# EAGLE schematic mainboard (EAGLE 9.4.2)

## Sheet 1 of 2
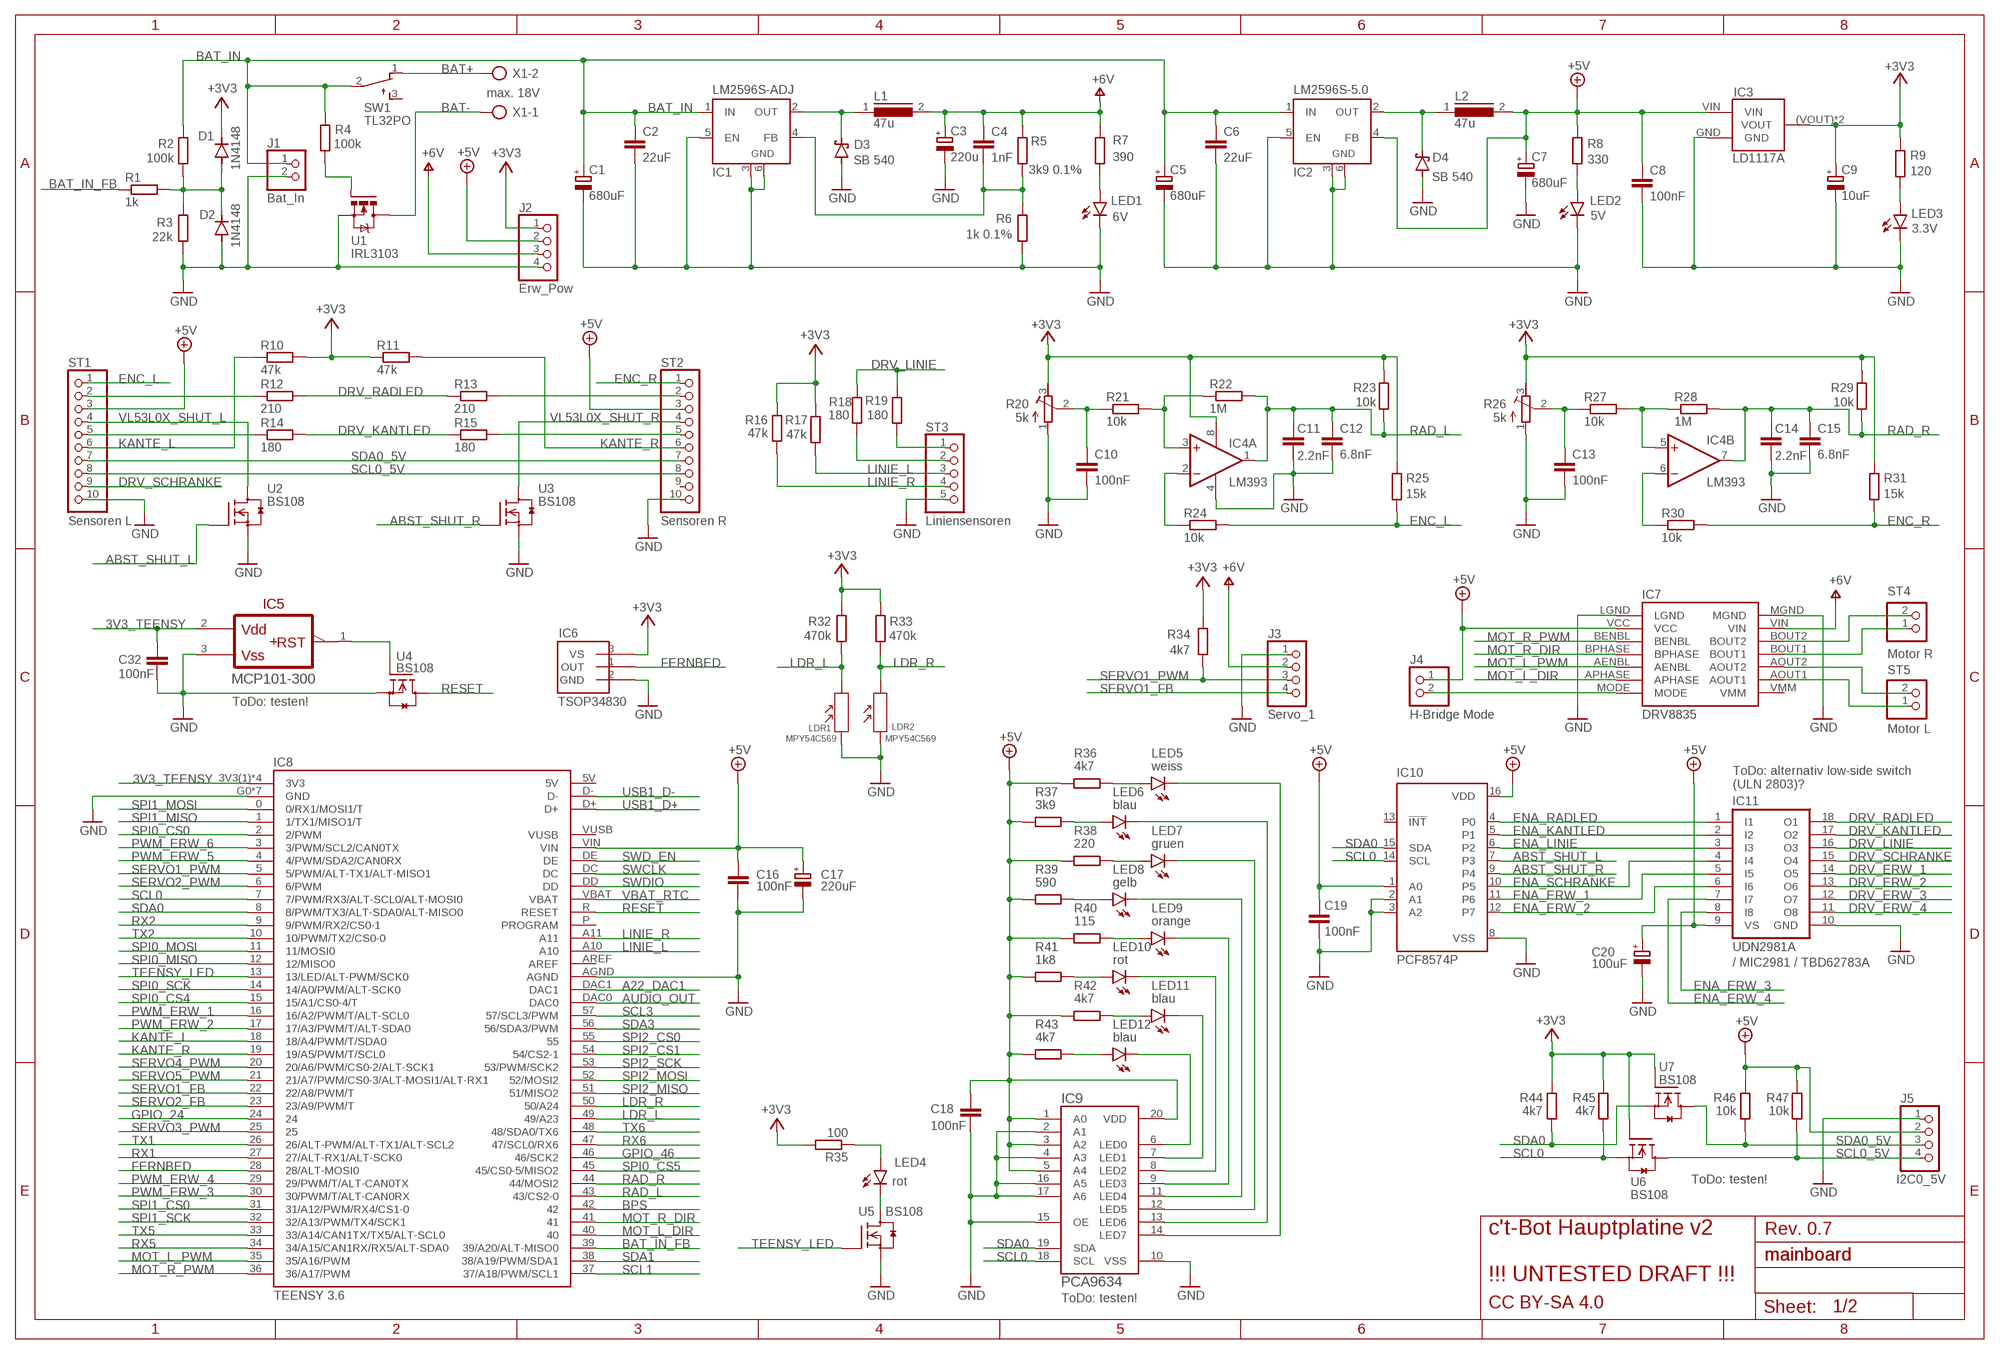
[diagram p0: schematic, sheet 1]

### Parts
C1  680uF  CPOL-EUE5-10.5  [E5-10,5]
C2  22uF  C-EU025-025X050  [C025-025X050]
C3  220u  CPOL-EUE5-10.5  [E5-10,5]
C4  1nF  C-EU025-025X050  [C025-025X050]
C5  680uF  CPOL-EUE5-10.5  [E5-10,5]
C6  22uF  C-EU025-025X050  [C025-025X050]
C7  680uF  CPOL-EUE5-10.5  [E5-10,5]
C8  100nF  C-EU025-025X050  [C025-025X050]
C9  10uF  CPOL-EUE2-5  [E2-5]
C10  100nF  C-EU025-025X050  [C025-025X050]
C11  2.2nF  C-EU025-025X050  [C025-025X050]
C12  6.8nF  C-EU025-025X050  [C025-025X050]
C13  100nF  C-EU025-025X050  [C025-025X050]
C14  2.2nF  C-EU025-025X050  [C025-025X050]
C15  6.8nF  C-EU025-025X050  [C025-025X050]
C16  100nF  C-EU025-025X050  [C025-025X050]
C17  220uF  CPOL-EUE2-5  [E2-5]
C18  100nF  C-EU025-025X050  [C025-025X050]
C19  100nF  C-EU025-025X050  [C025-025X050]
C20  100uF  CPOL-EUE2-5  [E2-5]
C32  100nF  C-EU025-025X050  [C025-025X050]
D1  1N4148  1N41480207/2V  [0207/2V]
D2  1N4148  1N41480207/2V  [0207/2V]
D3  SB 540  SCHOTTKY-DIODEDO201T15  [DO201T15]
D4  SB 540  SCHOTTKY-DIODEDO201T15  [DO201T15]
IC1  LM2596S-ADJ  LM2596S  [TO263-5]
IC2  LM2596S-5.0  LM2596S  [TO263-5]
IC3  LD1117A  LD1117  [LD1117SOT-223]
IC4  LM393  LM393N  [DIL08]
IC5  MCP101-300  MCP101  [TO-92]
IC6  TSOP34830  [TSOP348]
IC7  DRV8835  DRV8835THROUGHHOLE  [DRV8835]
IC8  TEENSY 3.6  TEENSY3_6  [T36]
IC9  PCA9634  PCA9634-SO20  [SO20W]
IC10  PCF8574P  [DIL16]
IC11  UDN2981A  [DIL18]
J1  Bat_In  PINHD-1X2  [1X02]
J2  Erw_Pow  PINHD-1X4  [1X04]
J3  Servo_1  PINHD-1X4  [1X04]
J4  H-Bridge Mode  PINHD-1X2  [1X02]
J5  I2C0_5V  PINHD-1X4  [1X04]
L1  47u  INDUCTOR_09HCP  [09HCP]
L2  47u  INDUCTOR_09HCP  [09HCP]
LDR1  MPY54C569  [SNR2-3.0]
LDR2  MPY54C569  [SNR2-3.0]
LED1  6V  LED3MM  [LED3MM]
LED2  5V  LED3MM  [LED3MM]
LED3  3.3V  LED3MM  [LED3MM]
LED4  rot  LED3MM  [LED3MM]
LED5  weiss  LED3MM  [LED3MM]
LED6  blau  LED3MM  [LED3MM]
LED7  gruen  LED3MM  [LED3MM]
LED8  gelb  LED3MM  [LED3MM]
LED9  orange  LED3MM  [LED3MM]
LED10  rot  LED3MM  [LED3MM]
LED11  blau  LED3MM  [LED3MM]
LED12  blau  LED3MM  [LED3MM]
R1  1k  R-EU_0204/2V  [0204V]
R2  100k  R-EU_0204/2V  [0204V]
R3  22k  R-EU_0204/2V  [0204V]
R4  100k  R-EU_0204/2V  [0204V]
R5  3k9 0.1%  R-EU_0204/2V  [0204V]
R6  1k 0.1%  R-EU_0204/2V  [0204V]
R7  390  R-EU_0204/2V  [0204V]
R8  330  R-EU_0204/2V  [0204V]
R9  120  R-EU_0204/2V  [0204V]
R10  47k  R-EU_0204/2V  [0204V]
R11  47k  R-EU_0204/2V  [0204V]
R12  210  R-EU_0204/2V  [0204V]
R13  210  R-EU_0204/2V  [0204V]
R14  180  R-EU_0204/2V  [0204V]
R15  180  R-EU_0204/2V  [0204V]
R16  47k  R-EU_0204/2V  [0204V]
R17  47k  R-EU_0204/2V  [0204V]
R18  180  R-EU_0204/2V  [0204V]
R19  180  R-EU_0204/2V  [0204V]
R20  5k  R-TRIMM64W  [RTRIM64W]
R21  10k  R-EU_0204/2V  [0204V]
R22  1M  R-EU_0204/2V  [0204V]
R23  10k  R-EU_0204/2V  [0204V]
R24  10k  R-EU_0204/2V  [0204V]
R25  15k  R-EU_0204/2V  [0204V]
R26  5k  R-TRIMM64W  [RTRIM64W]
R27  10k  R-EU_0204/2V  [0204V]
R28  1M  R-EU_0204/2V  [0204V]
R29  10k  R-EU_0204/2V  [0204V]
R30  10k  R-EU_0204/2V  [0204V]
R31  15k  R-EU_0204/2V  [0204V]
R32  470k  R-EU_0204/2V  [0204V]
R33  470k  R-EU_0204/2V  [0204V]
R34  4k7  R-EU_0204/2V  [0204V]
R35  100  R-EU_0204/2V  [0204V]
R36  4k7  R-EU_0204/2V  [0204V]
R37  3k9  R-EU_0204/2V  [0204V]
R38  220  R-EU_0204/2V  [0204V]
R39  590  R-EU_0204/2V  [0204V]
R40  115  R-EU_0204/2V  [0204V]
R41  1k8  R-EU_0204/2V  [0204V]
R42  4k7  R-EU_0204/2V  [0204V]
R43  4k7  R-EU_0204/2V  [0204V]
R44  4k7  R-EU_0204/2V  [0204V]
R45  4k7  R-EU_0204/2V  [0204V]
R46  10k  R-EU_0204/2V  [0204V]
R47  10k  R-EU_0204/2V  [0204V]
ST1  Sensoren L  PS25-10PS25-10  [TS_PS25_10]
ST2  Sensoren R  PS25-10PS25-10  [TS_PS25_10]
ST3  Liniensensoren  PS25-5PS25-5  [TS_PS25_5]
ST4  Motor R  PINHD90-1X2/90  [1X02/90]
ST5  Motor L  PINHD90-1X2/90  [1X02/90]
SW1  TL32PO  [TL3XPO]
U1  IRL3103  IRF740  [TO220BV]
U2  BS108  [SOT54E]
U3  BS108  [SOT54E]
U4  BS108  [SOT54E]
U5  BS108  [SOT54E]
U6  BS108  [SOT54E]
U7  BS108  [SOT54E]
X1  max. 18V  SCHRAUBKLEMME/2  [AK500/2-H]

### Nets
3V3_TEENSY: C32.1 IC5.2(VDD) IC8.3V3(1)(3V3) IC8.3V3(2)(3V3) IC8.3V3(3)(3V3) IC8.3V3(4)(3V3) ; also sheet 2
+3V3 [power]: C9.+ D1.2(C) IC3.(VOUT)(VOUT) IC3.VOUT IC4.8(P:V+) IC6.3(VS) J2.1 R9.2 R10.2 R11.1 R16.2 R17.2 R20.3(E) R23.2 R25.2 R26.3(E) R29.2 R31.2 R32.2 R33.2 R34.2 R35.2 R44.2 R45.2 U6.G U7.G ; also sheet 2
+5V [power]: C7.+ C8.1 C16.1 C17.+ C18.1 C19.1 C20.+ IC2.4(FB) IC3.VIN IC7.VCC IC8.VIN IC9.1(A0) IC9.3(A2) IC9.5(A4) IC9.20(VDD) IC10.1(A0) IC10.16(VDD) IC11.9(VS) J2.2 J4.1 J5.2 L2.2 R8.2 R36.1 R37.1 R38.1 R39.1 R40.1 R41.1 R42.1 R43.1 R46.2 R47.2 ST1.3 ST2.3 ; also sheet 2
+6V [high_current]: C3.+ C4.1 IC7.VIN J2.3 J3.2 L1.2 R5.2 R7.1 ; also sheet 2
A22_DAC1: IC8.DAC1 ; also sheet 2
ABST_SHUT_L: IC10.7(P3) U2.G
ABST_SHUT_R: IC10.9(P4) U3.G
AUDIO_OUT: IC8.DAC0 ; also sheet 2
BAT+ [high_current]: SW1.1(O) X1.2
BAT- [high_current]: U1.D X1.1
BAT_IN [high_current]: C1.+ C2.1 C5.+ C6.1 IC1.1(IN) IC2.1(IN) J1.1 R2.2 R4.2 SW1.2(P)
BAT_IN_FB: IC8.39(39/A20/ALT-MISO0) R1.1
BPS: IC8.42 ; also sheet 2
DRV_ERW_1 [power]: IC11.14(O5) ; also sheet 2
DRV_ERW_2 [power]: IC11.13(O6) ; also sheet 2
DRV_ERW_3 [power]: IC11.12(O7) ; also sheet 2
DRV_ERW_4 [power]: IC11.11(O8) ; also sheet 2
DRV_KANTLED [power]: IC11.17(O2) R14.2 R15.1
DRV_LINIE [power]: IC11.16(O3) R18.2 R19.2
DRV_RADLED [power]: IC11.18(O1) R12.2 R13.1
DRV_SCHRANKE [power]: IC11.15(O4) ST1.9
ENA_ERW_1: IC10.11(P6) IC11.5(I5) ; also sheet 2
ENA_ERW_2: IC10.12(P7) IC11.6(I6) ; also sheet 2
ENA_ERW_3: IC11.8(I8) ; also sheet 2
ENA_ERW_4: IC11.7(I7) ; also sheet 2
ENA_KANTLED: IC10.5(P1) IC11.2(I2)
ENA_LINIE: IC10.6(P2) IC11.3(I3)
ENA_RADLED: IC10.4(P0) IC11.1(I1)
ENA_SCHRANKE: IC10.10(P5) IC11.4(I4)
ENC_L: R24.2 R25.1 ST1.1
ENC_R: R30.2 R31.1 ST2.1
FERNBED: IC6.1(OUT) IC8.28(28/ALT-MOSI0)
GND [power]: C1.- C2.2 C3.- C5.- C6.2 C7.- C8.2 C9.- C10.2 C11.2 C12.2 C13.2 C14.2 C15.2 C16.2 C17.- C18.2 C19.2 C20.- C32.2 D2.1(A) D3.A D4.A IC1.3(GND) IC1.5(EN) IC1.6(GND) IC2.3(GND) IC2.5(EN) IC2.6(GND) IC3.GND IC4.4(P:V-) IC5.3(VSS) IC6.2(GND) IC7.LGND IC7.MGND IC8.AGND IC8.G0(GND) IC8.G1(GND) IC8.G2(GND) IC8.G3(GND) IC8.G4(GND) IC8.G5(GND) IC8.G6(GND) IC9.2(A1) IC9.4(A3) IC9.10(VSS) IC9.15(OE) IC9.16(A5) IC9.17(A6) IC10.2(A1) IC10.3(A2) IC10.8(VSS) IC11.10(GND) J1.2 J2.4 J3.1 J5.1 LDR1.1 LDR2.1 LED1.K(C) LED2.K(C) LED3.K(C) R3.1 R6.1 R20.1(A) R26.1(A) ST1.10 ST2.10 ST3.5 U1.S U2.S U3.S U4.S U5.S ; also sheet 2
GPIO_24: IC8.24 ; also sheet 2
GPIO_46: IC8.46(46/SCK2) ; also sheet 2
KANTE_L: IC8.18(18/A4/PWM/T/SDA0) R10.1 ST1.6
KANTE_R: IC8.19(19/A5/PWM/T/SCL0) R11.2 ST2.6
LDR_L: IC8.49(49/A23) LDR1.2 R32.1
LDR_R: IC8.50(50/A24) LDR2.2 R33.1
LINIE_L: IC8.A10 R17.1 ST3.3
LINIE_R: IC8.A11 R16.1 ST3.4
MOT_L_1 [high_current]: IC7.AOUT1 ST5.1
MOT_L_2 [high_current]: IC7.AOUT2 ST5.2
MOT_L_DIR: IC7.APHASE IC8.40
MOT_L_PWM: IC7.AENBL IC8.35(35/A16/PWM)
MOT_R_1 [high_current]: IC7.BOUT1 ST4.1
MOT_R_2 [high_current]: IC7.BOUT2 ST4.2
MOT_R_DIR: IC7.BPHASE IC8.41
MOT_R_PWM: IC7.BENBL IC8.36(36/A17/PWM)
N$1: R18.1 ST3.2
N$2: LED3.A R9.1
N$3: IC7.MODE J4.2
N$4: D1.1(A) D2.2(C) R1.2 R2.1 R3.2
N$5: IC4.2(A:-IN) R24.1
N$6: IC9.6(LED0) LED12.K(C)
N$7: IC9.7(LED1) LED11.K(C)
N$8 [power]: LED1.A R7.2
N$9: C4.2 IC1.4(FB) R5.1 R6.2
N$10: IC4.6(B:-IN) R30.1
N$11: LED2.A R8.1
N$13: IC9.8(LED2) LED10.K(C)
N$15: IC9.9(LED3) LED9.K(C)
N$16: IC9.11(LED4) LED8.K(C)
N$17: IC9.12(LED5) LED7.K(C)
N$18: IC9.13(LED6) LED6.K(C)
N$19: IC9.14(LED7) LED5.K(C)
N$20: LED5.A R36.2
N$21: LED6.A R37.2
N$22: LED7.A R38.2
N$23: LED8.A R39.2
N$24: LED9.A R40.2
N$25: LED10.A R41.2
N$26: LED11.A R42.2
N$27: LED12.A R43.2
N$28: LED4.A R35.1
N$29: LED4.K(C) U5.D
N$30: R19.1 ST3.1
N$34: C10.1 R20.2(S) R21.1
N$35: IC4.3(A:+IN) R21.2 R22.1
N$36: C13.1 R26.2(S) R27.1
N$37: IC4.5(B:+IN) R27.2 R28.1
N$38: R4.1 U1.G
N$39: IC5.1(!RST) U4.G
N$45: R13.2 ST2.2
N$47: R12.1 ST1.2
N$51: R14.1 ST1.5
N$53: R15.2 ST2.5
PWM_ERW_1: IC8.16(16/A2/PWM/T/ALT-SCL0) ; also sheet 2
PWM_ERW_2: IC8.17(17/A3/PWM/T/ALT-SDA0) ; also sheet 2
PWM_ERW_3: IC8.30(30/PWM/T/ALT-CAN0RX) ; also sheet 2
PWM_ERW_4: IC8.29(29/PWM/T/ALT-CAN0TX) ; also sheet 2
PWM_ERW_5: IC8.4(4/PWM/SDA2/CAN0RX) ; also sheet 2
PWM_ERW_6: IC8.3(3/PWM/SCL2/CAN0TX) ; also sheet 2
RAD_L: C11.1 C12.1 IC4.1(A:OUT) IC8.43(43/CS2-0) R22.2 R23.1
RAD_R: C14.1 C15.1 IC4.7(B:OUT) IC8.44(44/MOSI2) R28.2 R29.1
RESET: IC8.R(RESET) U4.D ; also sheet 2
RX1: IC8.27(27/ALT-RX1/ALT-SCK0) ; also sheet 2
RX2: IC8.9(9/PWM/RX2/CS0-1) ; also sheet 2
RX5: IC8.34(34/A15/CAN1RX/RX5/ALT-SDA0) ; also sheet 2
RX6: IC8.47(47/SCL0/RX6) ; also sheet 2
SCL0: IC8.7(7/PWM/RX3/ALT-SCL0/ALT-MOSI0) IC9.18(SCL) IC10.14(SCL) R45.1 U6.S ; also sheet 2
SCL0_5V: J5.4 R47.1 ST1.8 ST2.8 U6.D ; also sheet 2
SCL1: IC8.37(37/A18/PWM/SCL1) ; also sheet 2
SCL3: IC8.57(57/SCL3/PWM) ; also sheet 2
SDA0: IC8.8(8/PWM/TX3/ALT-SDA0/ALT-MISO0) IC9.19(SDA) IC10.15(SDA) R44.1 U7.S ; also sheet 2
SDA0_5V: J5.3 R46.1 ST1.7 ST2.7 U7.D ; also sheet 2
SDA1: IC8.38(38/A19/PWM/SDA1) ; also sheet 2
SDA3: IC8.56(56/SDA3/PWM) ; also sheet 2
SERVO1_FB: IC8.22(22/A8/PWM/T) J3.4
SERVO1_PWM: IC8.5(5/PWM/ALT-TX1/ALT-MISO1) J3.3 R34.1
SERVO2_FB: IC8.23(23/A9/PWM/T) ; also sheet 2
SERVO2_PWM: IC8.6(6/PWM) ; also sheet 2
SERVO3_PWM: IC8.25 ; also sheet 2
SERVO4_PWM: IC8.20(20/A6/PWM/CS0-2/ALT-SCK1) ; also sheet 2
SERVO5_PWM: IC8.21(21/A7/PWM/CS0-3/ALT-MOSI1/ALT-RX1) ; also sheet 2
SPI0_CS0: IC8.2(2/PWM) ; also sheet 2
SPI0_CS4: IC8.15(15/A1/CS0-4/T) ; also sheet 2
SPI0_CS5: IC8.45(45/CS0-5/MISO2) ; also sheet 2
SPI0_MISO: IC8.12(12/MISO0) ; also sheet 2
SPI0_MOSI: IC8.11(11/MOSI0) ; also sheet 2
SPI0_SCK: IC8.14(14/A0/PWM/ALT-SCK0) ; also sheet 2
SPI1_CS0: IC8.31(31/A12/PWM/RX4/CS1-0) ; also sheet 2
SPI1_MISO: IC8.1(1/TX1/MISO1/T) ; also sheet 2
SPI1_MOSI: IC8.0(0/RX1/MOSI1/T) ; also sheet 2
SPI1_SCK: IC8.32(32/A13/PWM/TX4/SCK1) ; also sheet 2
SPI2_CS0: IC8.55 ; also sheet 2
SPI2_CS1: IC8.54(54/CS2-1) ; also sheet 2
SPI2_MISO: IC8.51(51/MISO2) ; also sheet 2
SPI2_MOSI: IC8.52(52/MOSI2) ; also sheet 2
SPI2_SCK: IC8.53(53/PWM/SCK2) ; also sheet 2
SWCLK: IC8.DC ; also sheet 2
SWD_EN: IC8.DE ; also sheet 2
SWDIO: IC8.DD ; also sheet 2
TEENSY_LED: IC8.13(13/LED/ALT-PWM/SCK0) U5.G
TX1: IC8.26(26/ALT-PWM/ALT-TX1/ALT-SCL2) ; also sheet 2
TX2: IC8.10(10/PWM/TX2/CS0-0) ; also sheet 2
TX5: IC8.33(33/A14/CAN1TX/TX5/ALT-SCL0) ; also sheet 2
TX6: IC8.48(48/SDA0/TX6) ; also sheet 2
USB1_D+: IC8.D+ ; also sheet 2
USB1_D-: IC8.D- ; also sheet 2
V5_L1 [high_current]: D4.C IC2.2(OUT) L2.1
V6_L1 [high_current]: D3.C IC1.2(OUT) L1.1
VBAT_RTC: IC8.VBAT ; also sheet 2
VL53L0X_SHUT_L: ST1.4 U2.D
VL53L0X_SHUT_R: ST2.4 U3.D
Unconnected: IC7.VMM IC8.5V IC8.AREF IC8.P(PROGRAM) IC8.VUSB IC10.13(!INT) ST2.9 SW1.3(S)

### Notes on the sheet
- ToDo: testen!
- ToDo: alternativ low-side switch
  (ULN 2803)?
- / MIC2981 / TBD62783A
- ToDo: testen!
- Rev. 0.7
- mainboard
- c't-Bot Hauptplatine v2
  
  !!! UNTESTED DRAFT !!!
- ToDo: testen!
- CC BY-SA 4.0

## Sheet 2 of 2
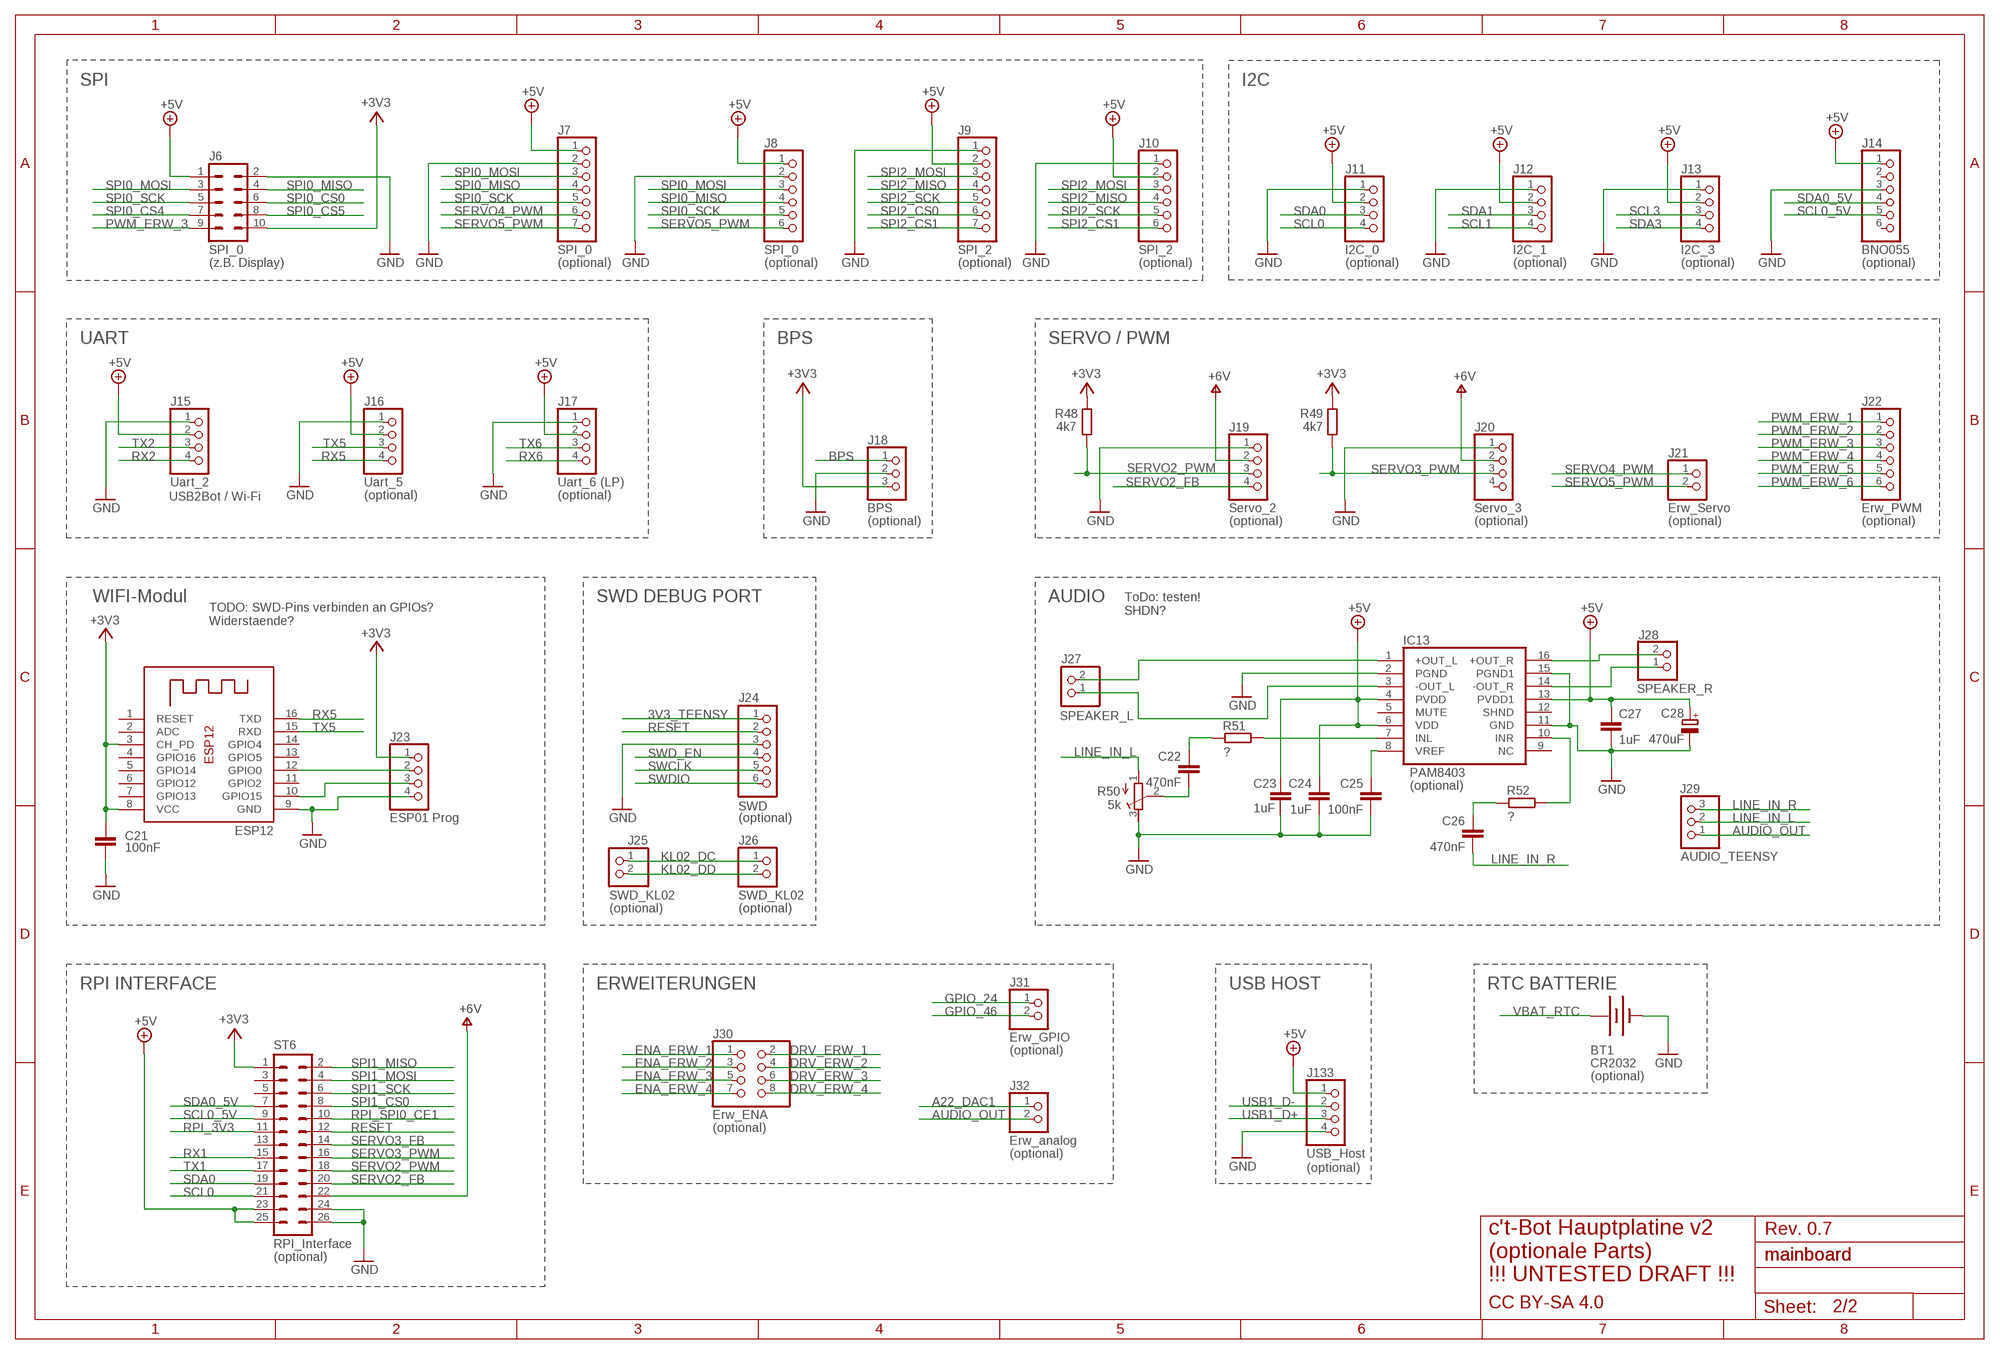
[diagram p1: schematic, sheet 2]

### Parts
BT1  CR2032  BATTERY-20MM_PTH  [00MM_PTH]
C21  100nF  C-EU025-025X050  [C025-025X050]
C22  470nF  C-EU025-025X050  [C025-025X050]
C23  1uF  C-EU025-025X050  [C025-025X050]
C24  1uF  C-EU025-025X050  [C025-025X050]
C25  100nF  C-EU025-025X050  [C025-025X050]
C26  470nF  C-EU025-025X050  [C025-025X050]
C27  1uF  C-EU025-025X050  [C025-025X050]
C28  470uF  CPOL-EUE3.5-8  [E3,5-8]
ESP-12  ESP-12  [ESP-12]
IC13  PAM8403  [SOP-16]
J6  SPI_0  ML10  [ML10]
J7  SPI_0  PINHD-1X7  [1X07]
J8  SPI_0  PINHD-1X6  [1X06]
J9  SPI_2  PINHD-1X7  [1X07]
J10  SPI_2  PINHD-1X6  [1X06]
J11  I2C_0  PINHD-1X4  [1X04]
J12  I2C_1  PINHD-1X4  [1X04]
J13  I2C_3  PINHD-1X4  [1X04]
J14  BNO055  PINHD-1X6  [1X06]
J15  Uart_2  PINHD-1X4  [1X04]
J16  Uart_5  PINHD-1X4  [1X04]
J17  Uart_6 (LP)  PINHD-1X4  [1X04]
J18  BPS  PINHD-1X3  [1X03]
J19  Servo_2  PINHD-1X4  [1X04]
J20  Servo_3  PINHD-1X4  [1X04]
J21  Erw_Servo  PINHD-1X2  [1X02]
J22  Erw_PWM  PINHD-1X6  [1X06]
J23  ESP01 Prog  PINHD-1X4  [1X04]
J24  SWD  PINHD-1X6  [1X06]
J25  SWD_KL02  PINHD90-1X2/90  [1X02/90]
J26  SWD_KL02  PINHD-1X2  [1X02]
J27  SPEAKER_L  PINHD-1X2  [1X02]
J28  SPEAKER_R  PINHD-1X2  [1X02]
J29  AUDIO_TEENSY  PINHD-1X3  [1X03]
J30  Erw_ENA  PINHD-2X4  [2X04]
J31  Erw_GPIO  PINHD-1X2  [1X02]
J32  Erw_analog  PINHD-1X2  [1X02]
J133  USB_Host  PINHD-1X4  [1X04]
R48  4k7  R-EU_0204/2V  [0204V]
R49  4k7  R-EU_0204/2V  [0204V]
R50  5k  R-TRIMM64W  [RTRIM64W]
R51  ?  R-EU_0204/2V  [0204V]
R52  ?  R-EU_0204/2V  [0204V]
ST6  RPI_Interface  ML26  [ML26]

### Nets
3V3_TEENSY: J24.1 ; also sheet 1
+3V3 [power]: C21.1 ESP-12.3(CH_PD) ESP-12.8(VCC) J6.10 J18.3 J23.1 R48.2 R49.2 ST6.1 ; also sheet 1
+5V [power]: C23.1 C24.1 C27.1 C28.+ IC13.4(PVDD) IC13.6(VDD) IC13.13(PVDD1) J6.1 J7.1 J8.1 J9.2 J10.2 J11.2 J12.2 J13.2 J14.1 J15.2 J16.2 J17.2 J133.1 ST6.23 ST6.25 ; also sheet 1
+6V [high_current]: J19.2 J20.2 ST6.22 ; also sheet 1
A22_DAC1: J32.1 ; also sheet 1
AUDIO_OUT: J29.1 J32.2 ; also sheet 1
BPS: J18.1 ; also sheet 1
DRV_ERW_1 [power]: J30.2 ; also sheet 1
DRV_ERW_2 [power]: J30.4 ; also sheet 1
DRV_ERW_3 [power]: J30.6 ; also sheet 1
DRV_ERW_4 [power]: J30.8 ; also sheet 1
ENA_ERW_1: J30.1 ; also sheet 1
ENA_ERW_2: J30.3 ; also sheet 1
ENA_ERW_3: J30.5 ; also sheet 1
ENA_ERW_4: J30.7 ; also sheet 1
GND [power]: BT1.2(-) C21.2 C23.2 C24.2 C25.2 C27.2 C28.- ESP-12.9(GND) IC13.2(PGND) IC13.11(GND) IC13.15(PGND1) J6.2 J7.2 J8.2 J9.1 J10.1 J11.1 J12.1 J13.1 J14.3 J15.1 J16.1 J17.1 J18.2 J19.1 J20.1 J23.4 J24.3 J133.4 R50.3(E) ST6.24 ST6.26 ; also sheet 1
GPIO_24: J31.1 ; also sheet 1
GPIO_46: J31.2 ; also sheet 1
KL02_DC: J25.1 J26.1
KL02_DD: J25.2 J26.2
LINE_IN_L: J29.2 R50.1(A)
LINE_IN_R: C26.2 J29.3
N$12: ESP-12.10(GPIO15) J23.3
N$14: ESP-12.12(GPIO0) J23.2
N$31: IC13.1(+OUT_L) J27.2
N$32: IC13.3(-OUT_L) J27.1
N$33: C25.1 IC13.8(VREF)
N$40: IC13.7(INL) R51.1
N$41: C22.1 R51.2
N$42: C22.2 R50.2(S)
N$43: IC13.14(-OUT_R) J28.1
N$44: IC13.16(+OUT_R) J28.2
N$46: IC13.10(INR) R52.1
N$48: C26.1 R52.2
PWM_ERW_1: J22.1 ; also sheet 1
PWM_ERW_2: J22.2 ; also sheet 1
PWM_ERW_3: J6.9 J22.3 ; also sheet 1
PWM_ERW_4: J22.4 ; also sheet 1
PWM_ERW_5: J22.5 ; also sheet 1
PWM_ERW_6: J22.6 ; also sheet 1
RESET: J24.2 ST6.12 ; also sheet 1
RPI_3V3: ST6.11
RPI_SPI0_CE1: ST6.10
RX1: ST6.15 ; also sheet 1
RX2: J15.4 ; also sheet 1
RX5: ESP-12.16(TXD) J16.4 ; also sheet 1
RX6: J17.4 ; also sheet 1
SCL0: J11.4 ST6.21 ; also sheet 1
SCL0_5V: J14.5 ST6.9 ; also sheet 1
SCL1: J12.4 ; also sheet 1
SCL3: J13.3 ; also sheet 1
SDA0: J11.3 ST6.19 ; also sheet 1
SDA0_5V: J14.4 ST6.7 ; also sheet 1
SDA1: J12.3 ; also sheet 1
SDA3: J13.4 ; also sheet 1
SERVO2_FB: J19.4 ST6.20 ; also sheet 1
SERVO2_PWM: J19.3 R48.1 ST6.18 ; also sheet 1
SERVO3_FB: ST6.14
SERVO3_PWM: J20.3 R49.1 ST6.16 ; also sheet 1
SERVO4_PWM: J7.6 J21.1 ; also sheet 1
SERVO5_PWM: J7.7 J8.6 J21.2 ; also sheet 1
SPI0_CS0: J6.6 ; also sheet 1
SPI0_CS4: J6.7 ; also sheet 1
SPI0_CS5: J6.8 ; also sheet 1
SPI0_MISO: J6.4 J7.4 J8.4 ; also sheet 1
SPI0_MOSI: J6.3 J7.3 J8.3 ; also sheet 1
SPI0_SCK: J6.5 J7.5 J8.5 ; also sheet 1
SPI1_CS0: ST6.8 ; also sheet 1
SPI1_MISO: ST6.2 ; also sheet 1
SPI1_MOSI: ST6.4 ; also sheet 1
SPI1_SCK: ST6.6 ; also sheet 1
SPI2_CS0: J9.6 ; also sheet 1
SPI2_CS1: J9.7 J10.6 ; also sheet 1
SPI2_MISO: J9.4 J10.4 ; also sheet 1
SPI2_MOSI: J9.3 J10.3 ; also sheet 1
SPI2_SCK: J9.5 J10.5 ; also sheet 1
SWCLK: J24.5 ; also sheet 1
SWD_EN: J24.4 ; also sheet 1
SWDIO: J24.6 ; also sheet 1
TX1: ST6.17 ; also sheet 1
TX2: J15.3 ; also sheet 1
TX5: ESP-12.15(RXD) J16.3 ; also sheet 1
TX6: J17.3 ; also sheet 1
USB1_D+: J133.3 ; also sheet 1
USB1_D-: J133.2 ; also sheet 1
VBAT_RTC: BT1.1(+) ; also sheet 1
Unconnected: ESP-12.1(RESET) ESP-12.2(ADC) ESP-12.4(GPIO16) ESP-12.5(GPIO14) ESP-12.6(GPIO12) ESP-12.7(GPIO13) ESP-12.11(GPIO2) ESP-12.13(GPIO5) ESP-12.14(GPIO4) IC13.5(MUTE) IC13.9(NC) IC13.12(SHND) J14.2 J14.6 J20.4 ST6.3 ST6.5 ST6.13

### Notes on the sheet
- SPI | I2C
- (z.B. Display) | (optional) | (optional) | (optional) | (optional) | (optional) | (optional) | (optional) | (optional)
- UART | BPS | SERVO / PWM
- USB2Bot / Wi-Fi | (optional) | (optional)
- (optional) | (optional) | (optional) | (optional) | (optional)
- ToDo: testen!
  SHDN?
- WIFI-Modul
- TODO: SWD-Pins verbinden an GPIOs?
  Widerstaende?
- SWD DEBUG PORT | AUDIO
- (optional)
- (optional)
- ESP12
- (optional) | (optional)
- RPI INTERFACE | ERWEITERUNGEN | USB HOST | RTC BATTERIE
- (optional)
- (optional)
- (optional)
- (optional)
- (optional)
- Rev. 0.7
- (optional) | mainboard
- c't-Bot Hauptplatine v2
  (optionale Parts)
  !!! UNTESTED DRAFT !!!
- CC BY-SA 4.0

## Library data of the parts
BT1 = ct-bot:BATTERY: Battery - Single Cell A variety of battery chemistries, sizes, and footprints. Device List: 20MM_PTH - Coin Cell Battery Holder - 20mm (PTH) <https://www.sparkfun.com/products/783> 6.8MM_PTH - Coin Cell Battery Holder - 6.8MM(SMD) <https://www.digikey.com/product-detail/en/seiko-instruments/MS621FE-FL11E/728-1057-ND/1889208?WT.srch=1&gclid=CNOQ5a6LzdQCFZS2wAodXCkE0g> 12MM_SMD - Coin Cell Battery Holder - 12mm (SMD) <https://www.sparkfun.com/products/10592> 12MM_PTH - Coin Cell Battery Holder - 12mm (PTH) <https://www.sparkfun.com/products/7948> 20MM_SMD - 20mm Coin Cell Battery Holder (SMD) (2 legs) Used on the Big Time Watch Kit <https://www.sparkfun.com/products/11734> 20MM_SMD_4LEGS - Coin Cell Battery Holder - 20mm (SMD) <https://www.sparkfun.com/products/11892> 20MM_SMD_4LEGS_OVERPASTE - Coin Cell Battery Holder - 20mm (SMD) <https://www.sparkfun.com/products/11892> (Over-paste on the legs) 24.5MM_PTH - Coin Cell Battery Holder - 24.5mm (PTH) <https://www.sparkfun.com/products/8863> 9V - 9V Battery Holder - PC Mount Used on the SparkFun SparkPunk Sound Kit <https://www.sparkfun.com/products/11177> and SparkFun SparkPunk Sequencer Kit <https://www.sparkfun.com/products/12707> 18650 - Battery Holder - 18650 (PTH) <https://www.sparkfun.com/products/13113> AA - Battery Holder - 1xAA (PTH) <https://www.sparkfun.com/products/7949> AAA - Battery Holder - 1xAAA (PTH) <https://www.sparkfun.com/products/12718> AA_KIT - Battery Holder - 1xAA (PTH) <https://www.sparkfun.com/products/7949> Special kit package - pads only have exposed copper on one side of the board. AAA_KIT - Battery Holder - 1xAAA (PTH) <https://www.sparkfun.com/products/12718> Special kit package - pads only have exposed copper on one side of the board.; PROD_ID: BATT-08316; SF_SKU: PRT-07949; VALUE: 6.8MM_COIN_CELL
C1 C3 C5 C7 C9 C17 C20 C28 = rcl:CPOL-EU: POLARIZED CAPACITOR, European symbol; SPICEPREFIX: C
C2 C4 C6 C8 C10-C16 C18 C19 C21-C27 C32 = rcl:C-EU: CAPACITOR, European symbol; SPICEPREFIX: C
D1 D2 = ct-bot:1N4148: DIODE high speed (Philips)
D3 D4 = diode:SCHOTTKY-DIODE: Schottky Diode
ESP-12 = adafruit:ESP-12
IC1 IC2 = ct-bot:LM2596S: STEP-DOWN VOLTAGE REGULATOR
IC3 = ct-bot:LD1117
IC4 = linear:LM393: COMPARATOR; SPICEPREFIX: J
IC5 = ct-bot:MCP101: MCP101 Microcontroller Supervisory Circuit
IC6 = ct-bot:TSOP348*: IR Receiver Modules for Remote Control Systems http://www.vishay.com/ir-receiver-modules/
IC7 = ct-bot:DRV8835
IC8 = ct-bot:TEENSY3_6
IC9 = ct-bot:PCA9634: NXP PCA9634 8-bit LED Controller
IC10 = ct-bot:PCF8574: I2C-Bus Remote 8-bit I/O expander http://www.semiconductors.philips.com/acrobat_download/datasheets/PCF8574_4.pdf; MPN: PCF8574PN; OC_FARNELL: 204020; OC_NEWARK: 11N8515
IC11 = ct-bot:UDN298*: DRIVER ARRAY Source: Allegro Microsystems Inc. / UDN2981-UDN2984.pdf
IC13 = ct-bot:PAM8403: Dual channel audio amplifier IC - PAM8403
J1 J4 J21 J26-J28 J31 J32 = ct-bot:PINHD-1X2: PIN HEADER
J2 J3 J5 J11-J13 J15-J17 J19 J20 J23 J133 = ct-bot:PINHD-1X4: PIN HEADER
J6 = con-harting-ml:ML10: HARTING; OC_FARNELL: unknown; OC_NEWARK: unknown
J7 J9 = ct-bot:PINHD-1X7: PIN HEADER
J8 J10 J14 J22 J24 = ct-bot:PINHD-1X6: PIN HEADER
J18 J29 = ct-bot:PINHD-1X3: PIN HEADER
J25 ST4 ST5 = ct-bot:PINHD90-1X2: PIN HEADER
J30 = pinhead:PINHD-2X4: PIN HEADER
L1 L2 = ct-bot:INDUCTOR_09HCP: INDUCTOR
LDR1 LDR2 = ct-bot:MPY54C569: 314020017; MPN: PHOTORESISTOR-5528-10K; VALUE: PHOTORESISTOR-5528-10K
LED1-LED12 = led:LED: LED OSRAM: - CHIPLED LG R971, LG N971, LY N971, LG Q971, LY Q971, LO R971, LY R971 LH N974, LH R974 LS Q976, LO Q976, LY Q976 LO Q996 - Hyper CHIPLED LW Q18S LB Q993, LB Q99A, LB R99A - SideLED LS A670, LO A670, LY A670, LG A670, LP A670 LB A673, LV A673, LT A673, LW A673 LH A674 LY A675 LS A676, LA A676, LO A676, LY A676, LW A676 LS A679, LY A679, LG A679 - Hyper Micro SIDELED® LS Y876, LA Y876, LO Y876, LY Y876 LT Y87S - SmartLED LW L88C, LW L88S LB L89C, LB L89S, LG L890 LS L89K, LO L89K, LY L89K LS L896, LA L896, LO L896, LY L896 - TOPLED LS T670, LO T670, LY T670, LG T670, LP T670 LSG T670, LSP T670, LSY T670, LOP T670, LYG T670 LG T671, LOG T671, LSG T671 LB T673, LV T673, LT T673, LW T673 LH T674 LS T676, LA T676, LO T676, LY T676, LB T676, LH T676, LSB T676, LW T676 LB T67C, LV T67C, LT T67C, LS T67K, LO T67K, LY T67K, LW E67C LS E67B, LA E67B, LO E67B, LY E67B, LB E67C, LV E67C, LT E67C LW T67C LS T679, LY T679, LG T679 LS T770, LO T770, LY T770, LG T770, LP T770 LB T773, LV T773, LT T773, LW T773 LH T774 LS E675, LA E675, LY E675, LS T675 LS T776, LA T776, LO T776, LY T776, LB T776 LHGB T686 LT T68C, LB T68C - Hyper Mini TOPLED® LB M676 - Mini TOPLED Santana® LG M470 LS M47K, LO M47K, LY M47K Source: http://www.osram.convergy.de LUXEON: - LUMILED® LXK2-PW12-R00, LXK2-PW12-S00, LXK2-PW14-U00, LXK2-PW14-V00 LXK2-PM12-R00, LXK2-PM12-S00, LXK2-PM14-U00 LXK2-PE12-Q00, LXK2-PE12-R00, LXK2-PE12-S00, LXK2-PE14-T00, LXK2-PE14-U00 LXK2-PB12-K00, LXK2-PB12-L00, LXK2-PB12-M00, LXK2-PB14-N00, LXK2-PB14-P00, LXK2-PB14-Q00 LXK2-PR12-L00, LXK2-PR12-M00, LXK2-PR14-Q00, LXK2-PR14-R00 LXK2-PD12-Q00, LXK2-PD12-R00, LXK2-PD12-S00 LXK2-PH12-R00, LXK2-PH12-S00 LXK2-PL12-P00, LXK2-PL12-Q00, LXK2-PL12-R00 Source: www.luxeon.com KINGBRIGHT: KA-3528ASYC Source: www.kingbright.com
R1-R19 R21-R25 R27-R49 R51 R52 = rcl:R-EU_: RESISTOR, European symbol; SPICEPREFIX: R
R20 R26 R50 = ct-bot:R-TRIMM: Trimm resistor; SPICEMODEL: X; SPICEPREFIXL: POT
ST1 ST2 = ct-bot:PS25-10: PIN HEADER
ST3 = ct-bot:PS25-5: PIN HEADER
ST6 = con-harting-ml:ML26: HARTING; OC_FARNELL: unknown; OC_NEWARK: unknown
SW1 = switch:TL32PO: TINY SWITCH ON - MOM Source: http://www2.produktinfo.conrad.com/datenblaetter/700000-724999/705152-da-01-de-Subminiaturschalter_TL_36YO.pdf
U1 = transistor-power:IRF740: N-CHANNEL MOS FET
U2-U7 = ct-bot:BS108: N-CHANNEL MOS FET
X1 = ct-bot:SCHRAUBKLEMME/2; OC_FARNELL: unknown; OC_NEWARK: unknown

## Net classes
0 default: width 0.203 mm, drill 0.33 mm, clearance 0.203 mm
1 power: width 0.305 mm, drill 0.33 mm, clearance 0.203 mm to class 0, clearance 0.203 mm
2 high_current: width 0.305 mm, drill 0.33 mm, clearance 0.203 mm to class 0, clearance 0.203 mm to class 1, clearance 0.203 mm